# Altium schematic sheet analog filterung.SchDoc: Sheetname
size A4; Date: 05.10.2017; CheckedBy: UNCHECKED; Author: Team Member; Organization: Team Starcraft e.V.; Address1: Oberweg 2; Address2: 98704 Langewiesen; Revision: xx.xx; SheetNumber: 01; SheetTotal: 01; Rules: TODO; ProjectName: Projekt
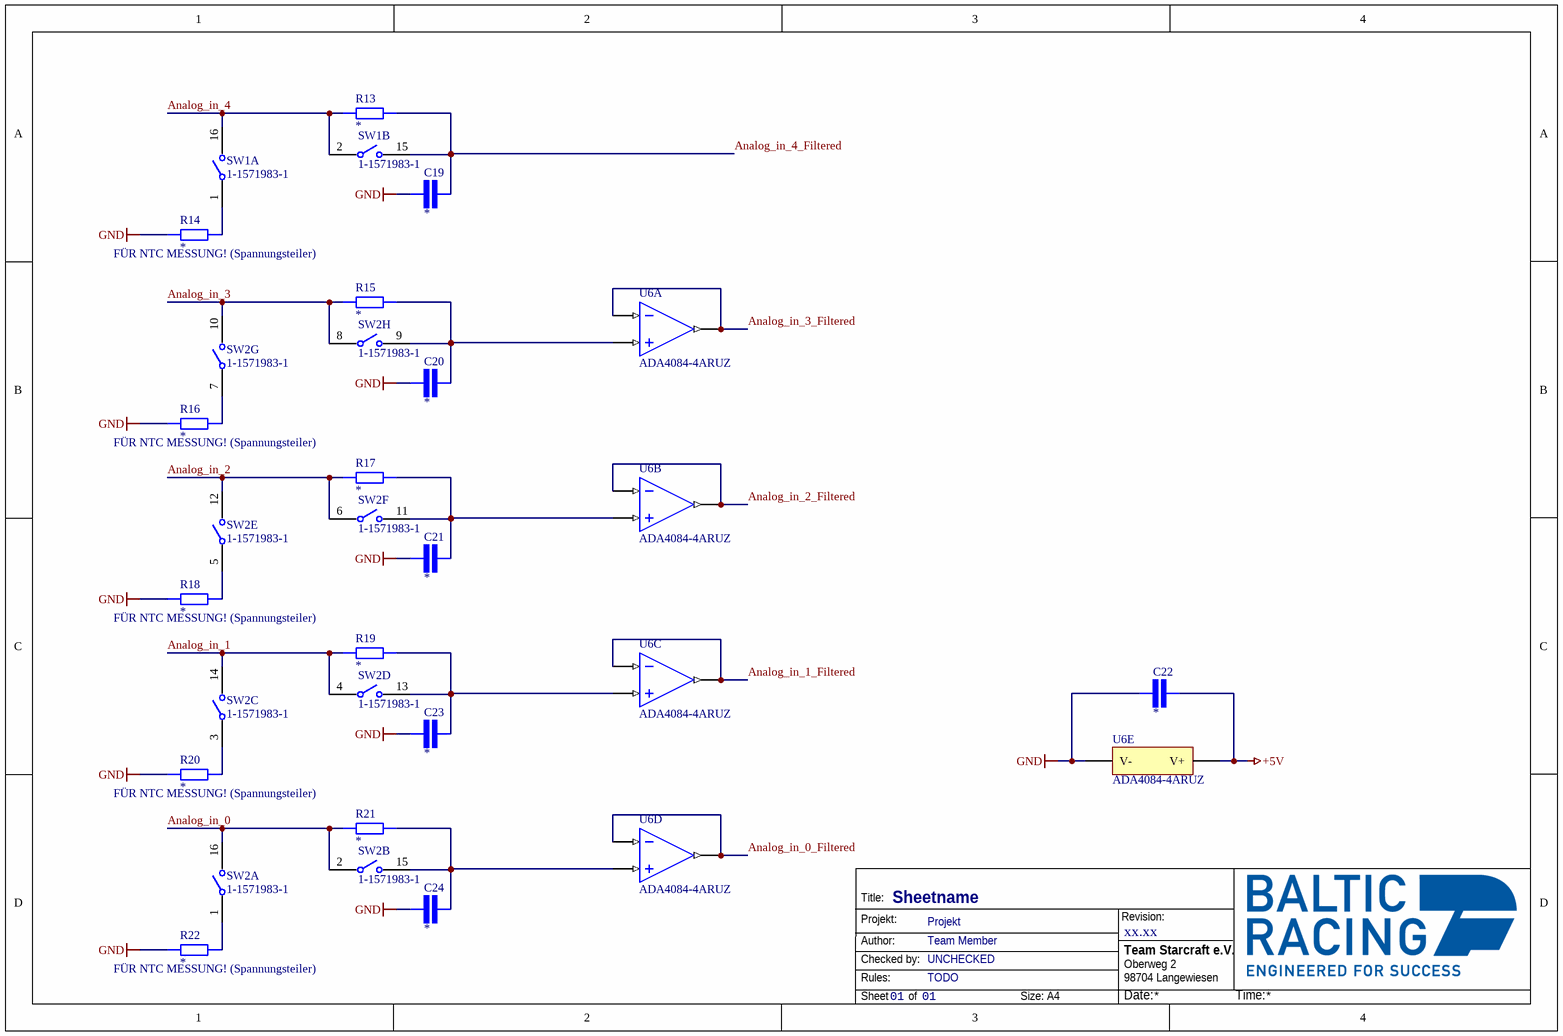
[diagram p0: analog filterung.SchDoc]

## Parts
C19  SMD Capacitor  [CAP 0603/1608]  (value not drawn)
C20  SMD Capacitor  [CAP 0603/1608]  (value not drawn)
C21  SMD Capacitor  [CAP 0603/1608]  (value not drawn)
C22  SMD Capacitor  [CAP 0603/1608]  (value not drawn)
C23  SMD Capacitor  [CAP 0603/1608]  (value not drawn)
C24  SMD Capacitor  [CAP 0603/1608]  (value not drawn)
R13  SMD Resistor  [STACKPOLE CSR0603]  (value not drawn)
R14  SMD Resistor  [STACKPOLE CSR0603]  (value not drawn)
R15  SMD Resistor  [STACKPOLE CSR0603]  (value not drawn)
R16  SMD Resistor  [STACKPOLE CSR0603]  (value not drawn)
R17  SMD Resistor  [STACKPOLE CSR0603]  (value not drawn)
R18  SMD Resistor  [STACKPOLE CSR0603]  (value not drawn)
R19  SMD Resistor  [STACKPOLE CSR0603]  (value not drawn)
R20  SMD Resistor  [STACKPOLE CSR0603]  (value not drawn)
R21  SMD Resistor  [STACKPOLE CSR0603]  (value not drawn)
R22  SMD Resistor  [STACKPOLE CSR0603]  (value not drawn)
SW1  1-1571983-1  [FP-1-1571983-1-MFG]  (parts A,B of 8)
SW2  1-1571983-1  [FP-1-1571983-1-MFG]  (parts A,B,C,D,E,F,G,H of 8)
U6  ADA4084-4ARUZ  [ANALOG_RU14]  (parts A,B,C,D,E of 5)

## Nets
+5V: C22.1 U6.4(V+)
GND: C19.1 C20.1 C21.1 C22.2 C23.1 C24.1 R14.1 R16.1 R18.1 R20.1 R22.1 U6.11(V-)
Analog_in_0: R21.2 SW2.2 SW2.16
Analog_in_0_Filtered: U6.13(-IN_D) U6.14(OUT_D)
Analog_in_1: R19.2 SW2.4 SW2.14
Analog_in_1_Filtered: U6.8(OUT_C) U6.9(-IN_C)
Analog_in_2: R17.2 SW2.6 SW2.12
Analog_in_2_Filtered: U6.6(-IN_B) U6.7(OUT_B)
Analog_in_3: R15.2 SW2.8 SW2.10
Analog_in_3_Filtered: U6.1(OUT_A) U6.2(-IN_A)
Analog_in_4: R13.2 SW1.2 SW1.16
Analog_in_4_Filtered: C19.2 R13.1 SW1.15
NetC20_2: C20.2 R15.1 SW2.9 U6.3(+IN_A)
NetC21_2: C21.2 R17.1 SW2.11 U6.5(+IN_B)
NetC23_2: C23.2 R19.1 SW2.13 U6.10(+IN_C)
NetC24_2: C24.2 R21.1 SW2.15 U6.12(+IN_D)
NetR14_2: R14.2 SW1.1
NetR16_2: R16.2 SW2.7
NetR18_2: R18.2 SW2.5
NetR20_2: R20.2 SW2.3
NetR22_2: R22.2 SW2.1

## Notes on the sheet
- (near R14) FÜR NTC MESSUNG! (Spannungsteiler)
- (near R16) FÜR NTC MESSUNG! (Spannungsteiler)
- (near R18) FÜR NTC MESSUNG! (Spannungsteiler)
- (near R20) FÜR NTC MESSUNG! (Spannungsteiler)
- (near R22) FÜR NTC MESSUNG! (Spannungsteiler)
- Title:
- Projekt:
- Revision:
- Author:
- Rules:
- Checked by:
- Sheet
- of
- Size:
- A4
- Date:
- Time:

## Library data of the parts
C19-C24 = SMD Capacitor: Capacitor with multiple Footprints; Value: *
R13-R22 = SMD Resistor: Resistor with multiple footprints; Value: *
SW1 SW2 = CMP-03400-000003-1: SWITCH SLIDE DIP SPST 25MA 24V; Manufacturer: TE Connectivity; Standoff Height: 0mm; Contact Resistance: 100mΩ; Voltage Rating Dc: 50V; Electromechanical Life: 1000Cycles; Number Of Circuits: 8; Temperature: -30°C to +85°C; Mouser Description: Switch DIP OFF ON SPST 8 Recessed Rocker 0.025A 24VDC Gull Wing 1.27mm SMD T/R; Temperature Range High: +85°C; Manufacturer Part Number: 1-1571983-1; Contact Current Rating: 25mA; Device Class L2: Switches; ComponentLink2Description: Datasheet; Category: Switch; ComponentLink2URL: https://www.te.com/commerce/DocumentDelivery/DDEController?Action=showdoc&DocId=Catalog+Section%7F1308111-1_SWITCHES_CORE_PROGRAM_CATALOG%7F0308%7Fpdf%7FEnglish%7FENG_CS_1308111-1_SWITCHES_CORE_PROGRAM_CATALOG_0308.pdf%7F1-1571983-1; Octopart: https://octopart.com/1-1571983-1-te+connectivity-40115518; Footprint Url: https://www.te.com/commerce/DocumentDelivery/DDEController?Action=showdoc&DocId=Customer+Drawing%7F1571983%7FC6%7Fpdf%7FEnglish%7FENG_CD_1571983_C6.pdf%7F1-1571983-1; Digikey Description: SWITCH SLIDE DIP SPST 25MA 24V; Device Class L3: DIP Switches; Mount: Surface Mount; Throw Configuration: SPST; RoHS: TRUE; Lead Free: Yes; Temperature Range Low: -30°C; Height: 2.56mm; Device Class L1: Electromechanical; Package: 1-1571983-1; Automotive: No
U6 = ADA4084-4ARUZ: 30 V, Low Noise, Rail-to-Rail Input/Output, Low Power Operational Amplifiers